# Altium project SVPXFMC_Carrier_3U.PrjPcb (part 6 of 7)

## Sheet SLT3-PAY-1Q2T_P1.SchDoc: SVPXFMC Carrier 3U
size A4; CheckedBy: \; Author: G.Kasprowicz; CompanyName: ISE; DrawnBy: T.Przywozki; Organization: WUT ISE; Address1: Warsaw University of Technology; Address2: Nowowiejska 15/19 00-665 Warsaw; Revision: 1.0.; SheetNumber: 13; SheetTotal: 20; Project: SVPXFMC Carrier 3U; ModifiedBy: -; CheckedDate: -; Title2: SpaceVPX P1, SLT3-PAY-1Q2T; DivGrp: ISE; Designer: G. Kasprowicz
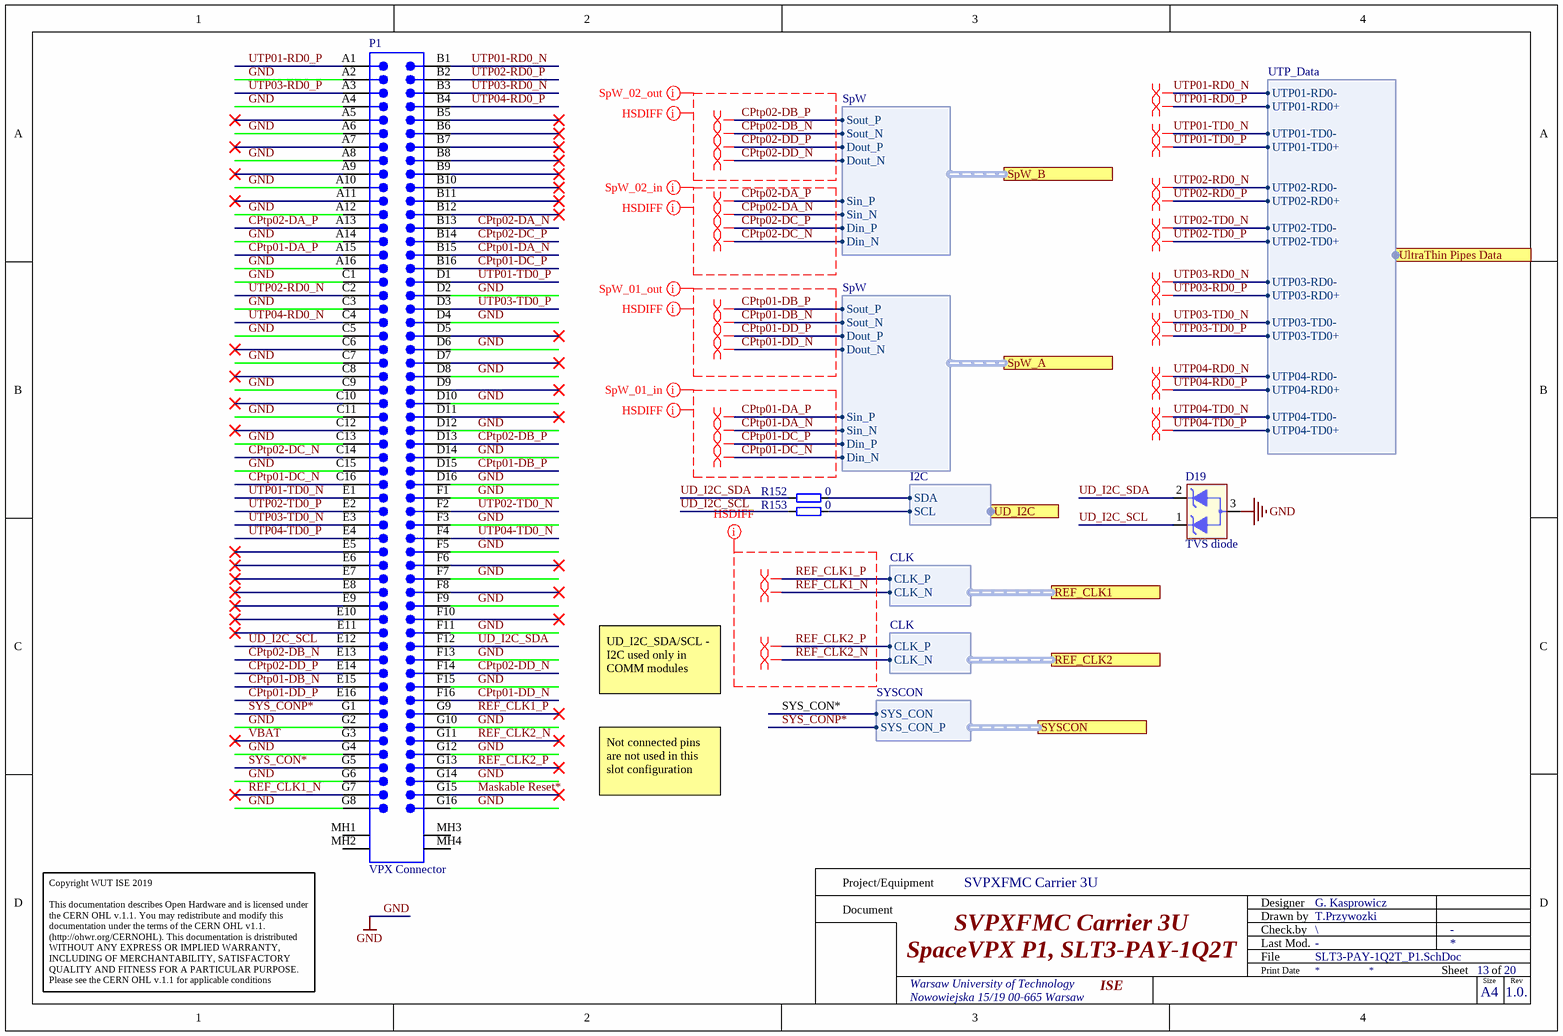
[diagram p14: SLT3-PAY-1Q2T_P1.SchDoc]

### Parts
D19  TVS diode  [SOT-723_(ESD7C3.3DT5G)]
P1  VPX Connector  [BTB1-8-4H112M]
R152  0  [RESC0603X28N]
R153  0  [RESC0603X28N]

### Ports
REF_CLK1 (harness CLK), REF_CLK2 (harness CLK), SpW_A (harness SpW), SpW_B (harness SpW), SYSCON (harness SYSCON), UD_I2C (harness I2C), UltraThin Pipes Data (harness UTP_Data)

### Harnesses
SpW: Sout_P, Sout_N, Dout_P, Dout_N, Sin_P, Sin_N, Din_P, Din_N
CLK: CLK_P, CLK_N
SYSCON: SYS_CON, SYS_CON_P
I2C: SDA, SCL
UTP_Data: UTP01-RD0-, UTP01-RD0+, UTP01-TD0-, UTP01-TD0+, UTP02-RD0-, UTP02-RD0+, UTP02-TD0-, UTP02-TD0+, UTP03-RD0-, UTP03-RD0+, UTP03-TD0-, UTP03-TD0+, UTP04-RD0-, UTP04-RD0+, UTP04-TD0-, UTP04-TD0+

### Nets
GND: D19.3 P1.A2 P1.A4 P1.A6 P1.A8 P1.A10 P1.A12 P1.A14 P1.A16 P1.C1 P1.C3 P1.C5 P1.C7 P1.C9 P1.C11 P1.C13 P1.C15 P1.D2 P1.D4 P1.D6 P1.D8 P1.D10 P1.D12 P1.D14 P1.D16 P1.F1 P1.F3 P1.F5 P1.F7 P1.F9 P1.F11 P1.F13 P1.F15 P1.G2 P1.G4 P1.G6 P1.G8 P1.G10 P1.G12 P1.G14 P1.G16
CPtp01-DA_N: P1.B15 ; port SpW_A.Sin_N
CPtp01-DA_P: P1.A15 ; port SpW_A.Sin_P
CPtp01-DB_N: P1.E15 ; port SpW_A.Sout_N
CPtp01-DB_P: P1.D15 ; port SpW_A.Sout_P
CPtp01-DC_N: P1.C16 ; port SpW_A.Din_N
CPtp01-DC_P: P1.B16 ; port SpW_A.Din_P
CPtp01-DD_N: P1.F16 ; port SpW_A.Dout_N
CPtp01-DD_P: P1.E16 ; port SpW_A.Dout_P
CPtp02-DA_N: P1.B13 ; port SpW_B.Sin_N
CPtp02-DA_P: P1.A13 ; port SpW_B.Sin_P
CPtp02-DB_N: P1.E13 ; port SpW_B.Sout_N
CPtp02-DB_P: P1.D13 ; port SpW_B.Sout_P
CPtp02-DC_N: P1.C14 ; port SpW_B.Din_N
CPtp02-DC_P: P1.B14 ; port SpW_B.Din_P
CPtp02-DD_N: P1.F14 ; port SpW_B.Dout_N
CPtp02-DD_P: P1.E14 ; port SpW_B.Dout_P
Maskable Reset*: P1.G15  [project net Maskable Reset*_13]
REF_CLK1_N: P1.G7 ; port REF_CLK1.CLK_N  [project net AUX_CLK_B_N]
REF_CLK1_P: P1.G9 ; port REF_CLK1.CLK_P  [project net AUX_CLK_B_P]
REF_CLK2_N: P1.G11 ; port REF_CLK2.CLK_N
REF_CLK2_P: P1.G13 ; port REF_CLK2.CLK_P
SYS_CON*: P1.G5 ; port SYSCON.SYS_CON  [project net SYS_CON]
SYS_CONP*: P1.G1 ; port SYSCON.SYS_CON_P  [project net SYS_CON_P]
UD_I2C_SCL: D19.1 P1.E12 R153.1  [project net UD_I2C_SCL_13]
UD_I2C_SDA: D19.2 P1.F12 R152.1  [project net UD_I2C_SDA_13]
UTP01-RD0_N: P1.B1 ; port UltraThin Pipes Data.UTP01-RD0-
UTP01-RD0_P: P1.A1 ; port UltraThin Pipes Data.UTP01-RD0+
UTP01-TD0_N: P1.E1 ; port UltraThin Pipes Data.UTP01-TD0-
UTP01-TD0_P: P1.D1 ; port UltraThin Pipes Data.UTP01-TD0+
UTP02-RD0_N: P1.C2 ; port UltraThin Pipes Data.UTP02-RD0-
UTP02-RD0_P: P1.B2 ; port UltraThin Pipes Data.UTP02-RD0+
UTP02-TD0_N: P1.F2 ; port UltraThin Pipes Data.UTP02-TD0-
UTP02-TD0_P: P1.E2 ; port UltraThin Pipes Data.UTP02-TD0+
UTP03-RD0_N: P1.B3 ; port UltraThin Pipes Data.UTP03-RD0-
UTP03-RD0_P: P1.A3 ; port UltraThin Pipes Data.UTP03-RD0+
UTP03-TD0_N: P1.E3 ; port UltraThin Pipes Data.UTP03-TD0-
UTP03-TD0_P: P1.D3 ; port UltraThin Pipes Data.UTP03-TD0+
UTP04-RD0_N: P1.C4 ; port UltraThin Pipes Data.UTP04-RD0-
UTP04-RD0_P: P1.B4 ; port UltraThin Pipes Data.UTP04-RD0+
UTP04-TD0_N: P1.F4 ; port UltraThin Pipes Data.UTP04-TD0-
UTP04-TD0_P: P1.E4 ; port UltraThin Pipes Data.UTP04-TD0+
VBAT: P1.G3  [project net VBAT_13]
NetR152_2: R152.2 ; port UD_I2C.SDA
NetR153_2: R153.2 ; port UD_I2C.SCL

Not connected (* = marked no-connect by the designer): P1 A5* A7* A9* A11* B5* B6* B7* B8* B9* B10* B11* B12* C6* C8* C10* C12* D5* D7* D9* D11* E5* E6* E7* E8* E9* E10* E11* F6* F8* F10* MH1 MH2 MH3 MH4

### Layout directives
differential pair: AUX_CLK_B_N, AUX_CLK_B_P, CPtp01-DA_N, CPtp01-DA_P, CPtp01-DB_N, CPtp01-DB_P, CPtp01-DC_N, CPtp01-DC_P, CPtp01-DD_N, CPtp01-DD_P, CPtp02-DA_N, CPtp02-DA_P, CPtp02-DB_N, CPtp02-DB_P, CPtp02-DC_N, CPtp02-DC_P, CPtp02-DD_N, CPtp02-DD_P, REF_CLK2_N, REF_CLK2_P, UTP01-RD0_N, UTP01-RD0_P, UTP01-TD0_N, UTP01-TD0_P, UTP02-RD0_N, UTP02-RD0_P, UTP02-TD0_N, UTP02-TD0_P, UTP03-RD0_N, UTP03-RD0_P, UTP03-TD0_N, UTP03-TD0_P, UTP04-RD0_N, UTP04-RD0_P, UTP04-TD0_N, UTP04-TD0_P
net class SpW_02_out: CPtp02-DB_N, CPtp02-DB_P, CPtp02-DD_N, CPtp02-DD_P
net class SpW_02_in: CPtp02-DA_N, CPtp02-DA_P, CPtp02-DC_N, CPtp02-DC_P
net class SpW_01_out: CPtp01-DB_N, CPtp01-DB_P, CPtp01-DD_N, CPtp01-DD_P
net class SpW_01_in: CPtp01-DA_N, CPtp01-DA_P, CPtp01-DC_N, CPtp01-DC_P
net class HSDIFF: CPtp01-DA_N, CPtp01-DA_P, CPtp01-DB_N, CPtp01-DB_P, CPtp01-DC_N, CPtp01-DC_P, CPtp01-DD_N, CPtp01-DD_P, CPtp02-DA_N, CPtp02-DA_P, CPtp02-DB_N, CPtp02-DB_P, CPtp02-DC_N, CPtp02-DC_P, CPtp02-DD_N, CPtp02-DD_P, REF_CLK1_N, REF_CLK1_P, REF_CLK2_N, REF_CLK2_P

### Notes on the sheet
- UD_I2C_SDA/SCL - I2C used only in COMM modules
- Not connected pins are not used in this slot configuration
- Project/Equipment
- Document
- Designer
- Drawn by
- Check.by
- Copyright WUT ISE 2019
  This documentation describes Open Hardware and is licensed under the CERN OHL v.1.1. You may redistribute and modify this documentation under the terms of the CERN OHL v1.1.
  (http://ohwr.org/CERNOHL). This documentation is dristributed WITHOUT ANY EXPRESS OR IMPLIED WARRANTY, INCLUDING OF MERCHANTABILITY, SATISFACTORY QUALITY AND FITNESS FOR A PARTICULAR PURPOSE. Please see the CERN OHL v.1.1 for applicable conditions
- File
- Last Mod.
- Print Date
- Sheet
- Size
- A4
- of
- Rev

### Library data of the parts
D19 = ESD7C3.3DT5G: Dual TVS diode, Vrwm=3.3V; Manufacturer: ON Semiconductor; Bonding: No; ComponentHeigth: 0.5mm; PressFit: No; Value: 3.3V; Case: SOT-723; Component Kind: Standard; Component Type: Standard; CreateDate: 2018-06-18; Device: TVS diode; HelpURL: https://www.onsemi.com/pub/Collateral/ESD7C3.3D-D.PDF; LatestRevisionDate: 2018-06-18; Manufacturer Part Number: ESD7C3.3DT5G; Mounted: Yes; PackageDescription: SOT-723; Part Description: TVS diode; Part Number: ESD7C3.3DT5G; Pin Count: 3; Sense: No; SMD: Yes; Socket: No
P1 = 2102771-1: Ruggedized Board-to-Board Connector, Right Angle, 7-Row, Pitch 1.8mm, 112-Position; Manufacturer: TE; Bonding: No; ComponentHeigth: 14.7mm; PressFit: No; Case: *; Component Kind: Standard; Component Type: Standard; CreateDate: 2018-01-01; Device: *; Footprint: *; HelpURL: *; LatestRevisionDate: 2018-01-01; Manufacturer Part Number: 2102771-1; Mounted: Yes; PackageDescription: 2102771-1; Part Description: Ruggedized Board-to-Board Connector, Right Angle, 7-Row, Pitch 1.8mm, 112-Position; Part Number: 2102771-1; Pin Count: *; Sense: No; SMD: Yes; Socket: No; Family: VPX Connector
R152 R153 = R0201_0R_JUMPER: Resistor; Part Description: 1A (0.05R Max DC Resistance) Zero Ohm Jumper; Manufacturer: GENERIC; Manufacturer1 Part Number: CRCW02010000Z0ED; PressFit: No; Part Number: R0201_0R_JUMPER; Component Kind: Standard; Component Type: Standard; Pin Count: 2; Value: 0; Status: Not Recommended; Manufacturer Part Number: R0201_0R_JUMPER; Case: 0201; Mounted: Yes; Sense: No; Socket: No; SMD: Yes; Manufacturer1 Example: VISHAY; Manufacturer1 ComponentHeight: 0.27mm; HelpURL: \\cern.ch\dfs\Applications\Altium\Datasheets\R0201_VISHAY_CRCW e3.pdf; Author: CERN DEM JLC; CreateDate: 19.11.2014; LatestRevisionDate: 08.01.2015

## Sheet SLT3-PAY-1Q2T_P2.SchDoc: SVPXFMC Carrier 3U
size A4; CheckedBy: \; Author: G.Kasprowicz; CompanyName: ISE; DrawnBy: T.Przywozki; Organization: WUT ISE; Address1: Warsaw University of Technology; Address2: Nowowiejska 15/19 00-665 Warsaw; Revision: 1.0.; SheetNumber: 12; SheetTotal: 20; Project: SVPXFMC Carrier 3U; ModifiedBy: -; CheckedDate: -; Title2: SpaceVPX P2, SLT3-PAY-1Q2T; DivGrp: ISE; Designer: G. Kasprowicz
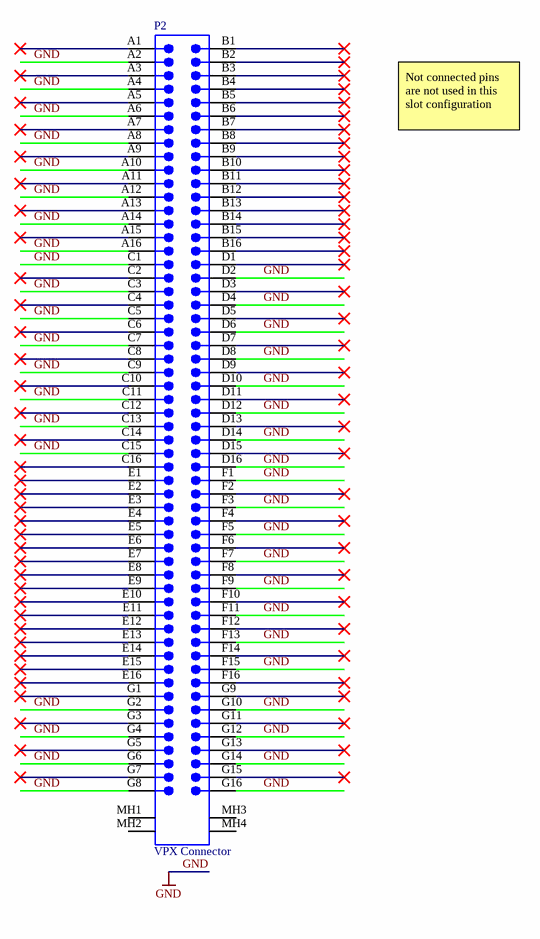
[diagram p15: SLT3-PAY-1Q2T_P2.SchDoc]

### Parts
P2  VPX Connector  [BTB1-8-4H112M]

### Nets
GND: P2.A2 P2.A4 P2.A6 P2.A8 P2.A10 P2.A12 P2.A14 P2.A16 P2.C1 P2.C3 P2.C5 P2.C7 P2.C9 P2.C11 P2.C13 P2.C15 P2.D2 P2.D4 P2.D6 P2.D8 P2.D10 P2.D12 P2.D14 P2.D16 P2.F1 P2.F3 P2.F5 P2.F7 P2.F9 P2.F11 P2.F13 P2.F15 P2.G2 P2.G4 P2.G6 P2.G8 P2.G10 P2.G12 P2.G14 P2.G16

Not connected (* = marked no-connect by the designer): P2 A1* A3* A5* A7* A9* A11* A13* A15* B1* B2* B3* B4* B5* B6* B7* B8* B9* B10* B11* B12* B13* B14* B15* B16* C2* C4* C6* C8* C10* C12* C14* C16* D1* D3* D5* D7* D9* D11* D13* D15* E1* E2* E3* E4* E5* E6* E7* E8* E9* E10* E11* E12* E13* E14* E15* E16* F2* F4* F6* F8* F10* F12* F14* F16* G1* G3* G5* G7* G9* G11* G13* G15* MH1 MH2 MH3 MH4

### Notes on the sheet
- Not connected pins are not used in this slot configuration
- Project/Equipment
- Document
- Designer
- Drawn by
- Check.by
- Copyright WUT ISE 2019
  This documentation describes Open Hardware and is licensed under the CERN OHL v.1.1. You may redistribute and modify this documentation under the terms of the CERN OHL v1.1.
  (http://ohwr.org/CERNOHL). This documentation is dristributed WITHOUT ANY EXPRESS OR IMPLIED WARRANTY, INCLUDING OF MERCHANTABILITY, SATISFACTORY QUALITY AND FITNESS FOR A PARTICULAR PURPOSE. Please see the CERN OHL v.1.1 for applicable conditions
- File
- Last Mod.
- Print Date
- Sheet
- Size
- A4
- of
- Rev

### Library data of the parts
P2 = 2102771-1: as P1 on sheet SLT3-PAY-1Q2T_P1; Case: *; Component Kind: Standard; Component Type: Standard; CreateDate: 2018-01-01; Device: *; Footprint: *; HelpURL: *; LatestRevisionDate: 2018-01-01; Manufacturer Part Number: 2102771-1; Mounted: Yes; PackageDescription: 2102771-1; Part Description: Ruggedized Board-to-Board Connector, Right Angle, 7-Row, Pitch 1.8mm, 112-Position; Part Number: 2102771-1; Pin Count: *; Sense: No; SMD: Yes; Socket: No; Family: VPX Connector

## Sheet Management.SchDoc: SVPXFMC Carrier 3U
size A4; CheckedBy: \; Author: G.Kasprowicz; CompanyName: ISE; DrawnBy: T.Przywozki; Organization: WUT ISE; Address1: Warsaw University of Technology; Address2: Nowowiejska 15/19 00-665 Warsaw; Revision: 1.0.; SheetNumber: 16; SheetTotal: 20; Project: SVPXFMC Carrier 3U; ModifiedBy: -; CheckedDate: -; Title2: MSP430 management MCU; DivGrp: ISE; Designer: G. Kasprowicz
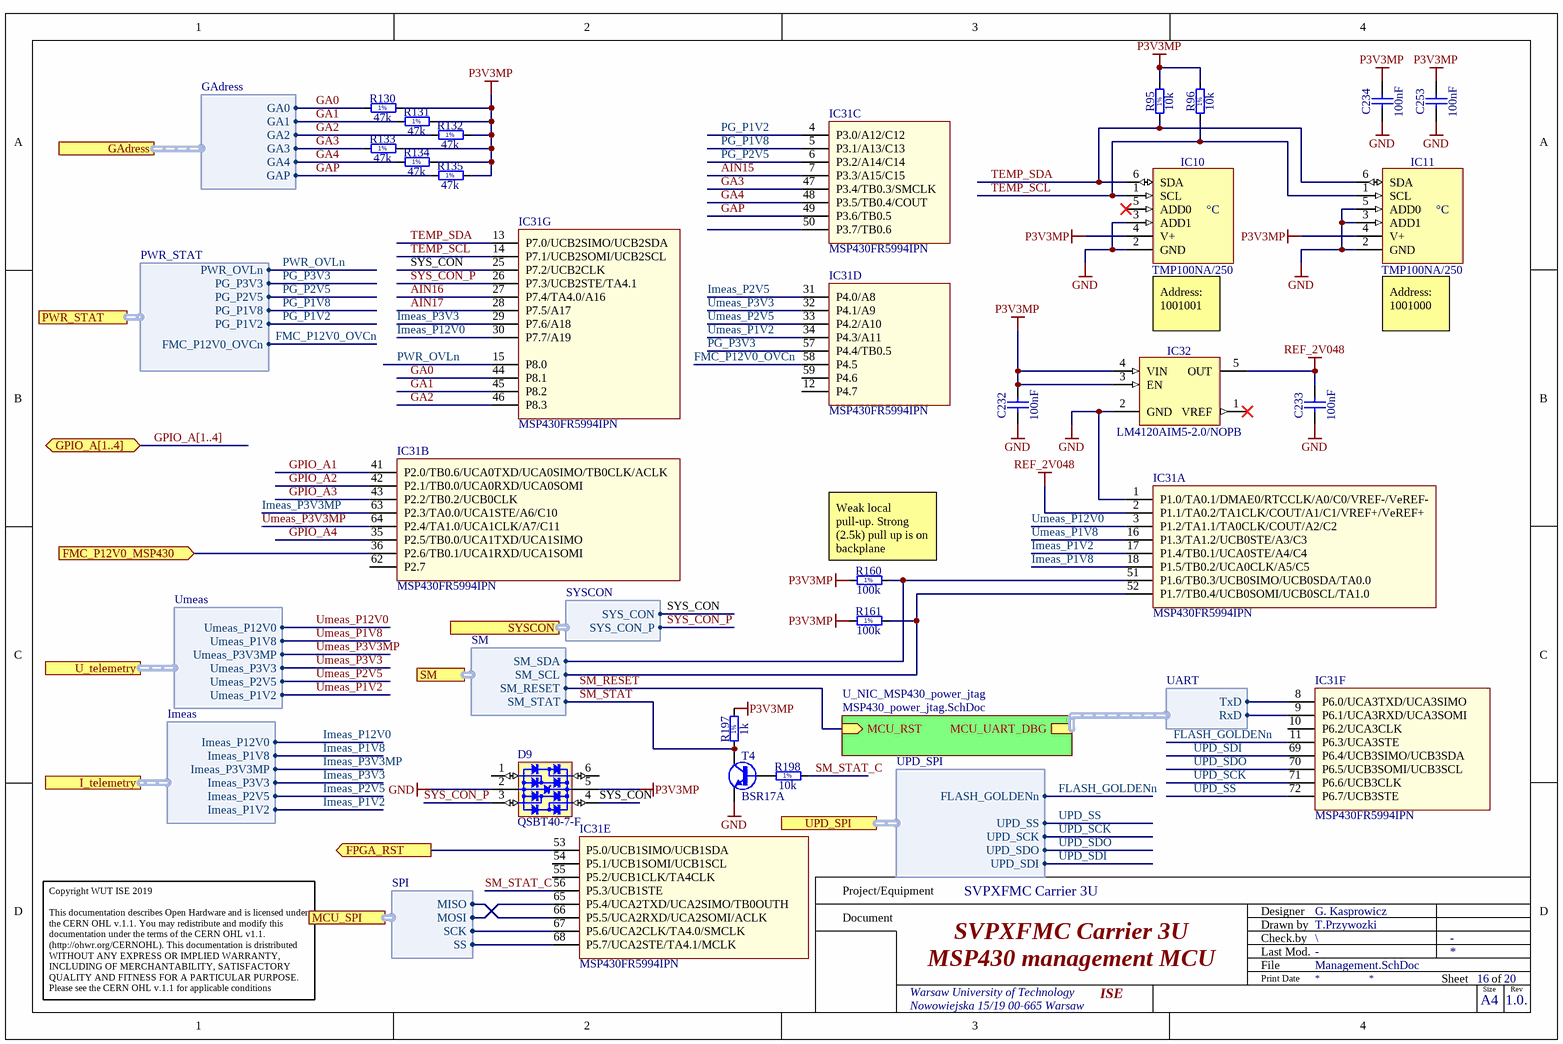
[diagram p16: Management.SchDoc]

### Parts
C232  100nF  [CAPC1005X55N]
C233  100nF  [CAPC1005X55N]
C234  100nF  [CAPC1005X55N]
C253  100nF  [CAPC1005X55N]
D9  QSBT40-7-F  [SOT65P210X110-6N]
IC10  TMP100NA/250  [SOT95P280X145-6N]
IC11  TMP100NA/250  [SOT95P280X145-6N]
IC31  MSP430FR5994IPN  [PQFP50P1400X1400-80N]  (parts A,B,C,D,E,F,G of 9)
IC32  LM4120AIM5-2.0/NOPB  [SOT95P280X145-5N]
R95  10k  [RESC1005X40N]
R96  10k  [RESC1005X40N]
R130  47k  [RESC1005X40N]
R131  47k  [RESC1005X40N]
R132  47k  [RESC1005X40N]
R133  47k  [RESC1005X40N]
R134  47k  [RESC1005X40N]
R135  47k  [RESC1005X40N]
R160  100k  [RESC1005X40N]
R161  100k  [RESC1005X40N]
R197  1k  [RESC1005X40N]
R198  10k  [RESC1005X40N]
T4  BSR17A  [SOT95P240X110-3N]

### Sub-sheets
U_NIC_MSP430_power_jtag = MSP430_power_jtag.SchDoc: MCU_UART_DBG (harness UART), MCU_RST (in)

### Ports
FMC_P12V0_MSP430 (in), FPGA_RST (out), GAdress (harness GAdress), GPIO_A[1..4] (bidir), I_telemetry (harness Imeas), MCU_SPI (harness SPI), PWR_STAT (harness PWR_STAT), SM (harness SM), SYSCON (harness SYSCON), U_telemetry (harness Umeas), UPD_SPI (harness UPD_SPI)

### Harnesses
SPI: MISO, MOSI, SCK, SS
UART: TxD, RxD
SM: SM_SCL, SM_SDA, SM_RESET, SM_STAT
GAdress: GA0, GA1, GA2, GA3, GA4, GAP
PWR_STAT: FMC_P12V0_OVCn, PG_P1V2, PG_P1V8, PG_P2V5, PG_P3V3, PWR_OVLn
SYSCON: SYS_CON, SYS_CON_P
UPD_SPI: UPD_SS, UPD_SCK, UPD_SDO, UPD_SDI, FLASH_GOLDENn
Imeas: Imeas_P12V0, Imeas_P1V8, Imeas_P3V3, Imeas_P2V5, Imeas_P1V2, Imeas_P3V3MP
Umeas: Umeas_P12V0, Umeas_P1V8, Umeas_P3V3, Umeas_P2V5, Umeas_P1V2, Umeas_P3V3MP

### Nets
GND: C232.1 C233.1 C234.1 C253.1 D9.2(GND) IC10.2(GND) IC10.3(ADD1) IC11.2(GND) IC11.3(ADD1) IC11.5(ADD0) IC31.1(P1.0/TA0.1/DMAE0/RTCCLK/A0/C0/VREF-/VeREF-) IC32.2(GND) T4.2(E)
P3V3MP: C232.2 C234.2 C253.2 D9.5(VBUS) IC10.4(V+) IC11.4(V+) IC32.3(EN) IC32.4(VIN) R95.2 R96.2 R130.2 R131.2 R132.2 R133.2 R134.2 R135.2 R160.1 R161.1 R197.2
REF_2V048: C233.2 IC31.2(P1.1/TA0.2/TA1CLK/COUT/A1/C1/VREF+/VeREF+) IC32.5(OUT)
AIN15: IC31.7(P3.3/A15/C15)  [project net AIN15_16]
AIN16: IC31.27(P7.4/TA4.0/A16)  [project net AIN16_16]
AIN17: IC31.28(P7.5/A17)  [project net AIN17_16]
EXT_RST_2: IC31.53(P5.0/UCB1SIMO/UCB1SDA) ; port FPGA_RST
FLASH_GOLDENn: IC31.11(P6.3/UCA3STE) ; port UPD_SPI.FLASH_GOLDENn
FMC_P12V0_MSP430: IC31.36(P2.6/TB0.1/UCA1RXD/UCA1SOMI) ; port FMC_P12V0_MSP430
FMC_P12V0_OVCn: IC31.58(P4.5) ; port PWR_STAT.FMC_P12V0_OVCn
GA0: IC31.44(P8.1) R130.1 ; port GAdress.GA0
GA1: IC31.45(P8.2) R131.1 ; port GAdress.GA1
GA2: IC31.46(P8.3) R132.1 ; port GAdress.GA2
GA3: IC31.47(P3.4/TB0.3/SMCLK) R133.1 ; port GAdress.GA3
GA4: IC31.48(P3.5/TB0.4/COUT) R134.1 ; port GAdress.GA4
GAP: IC31.49(P3.6/TB0.5) R135.1 ; port GAdress.GAP
GPIO_A1: IC31.41(P2.0/TB0.6/UCA0TXD/UCA0SIMO/TB0CLK/ACLK)
GPIO_A2: IC31.42(P2.1/TB0.0/UCA0RXD/UCA0SOMI)
GPIO_A3: IC31.43(P2.2/TB0.2/UCB0CLK)
GPIO_A4: IC31.35(P2.5/TB0.0/UCA1TXD/UCA1SIMO)
Imeas_P1V2: IC31.17(P1.4/TB0.1/UCA0STE/A4/C4) ; port I_telemetry.Imeas_P1V2
Imeas_P1V8: IC31.18(P1.5/TB0.2/UCA0CLK/A5/C5) ; port I_telemetry.Imeas_P1V8
Imeas_P2V5: IC31.31(P4.0/A8) ; port I_telemetry.Imeas_P2V5
Imeas_P3V3: IC31.29(P7.6/A18) ; port I_telemetry.Imeas_P3V3
Imeas_P3V3MP: IC31.63(P2.3/TA0.0/UCA1STE/A6/C10) ; port I_telemetry.Imeas_P3V3MP
Imeas_P12V0: IC31.30(P7.7/A19) ; port I_telemetry.Imeas_P12V0
PG_P1V2: IC31.4(P3.0/A12/C12) ; port PWR_STAT.PG_P1V2
PG_P1V8: IC31.5(P3.1/A13/C13) ; port PWR_STAT.PG_P1V8
PG_P2V5: IC31.6(P3.2/A14/C14) ; port PWR_STAT.PG_P2V5
PG_P3V3: IC31.57(P4.4/TB0.5) ; port PWR_STAT.PG_P3V3
PWR_OVLn: IC31.15(P8.0) ; port PWR_STAT.PWR_OVLn
RxD: IC31.9(P6.1/UCA3RXD/UCA3SOMI) ; sheet U_NIC_MSP430_power_jtag/MCU_UART_DBG.RxD
SM0: IC31.52(P1.7/TB0.4/UCB0SOMI/UCB0SCL/TA1.0) R161.2 ; port SM.SM_SCL
SM1: IC31.51(P1.6/TB0.3/UCB0SIMO/UCB0SDA/TA0.0) R160.2 ; port SM.SM_SDA
SM_RESET: sheet U_NIC_MSP430_power_jtag/MCU_RST, port SM.SM_RESET  [project net SM2]
SM_STAT: R197.1 T4.3(C) ; port SM.SM_STAT  [project net SM3]
SM_STAT_C: IC31.56(P5.3/UCB1STE) R198.2  [project net SM_STAT_C_16]
SYS_CON: D9.4(I/O3) IC31.25(P7.2/UCB2CLK) ; port SYSCON.SYS_CON
SYS_CON_P: D9.3(I/O2) IC31.26(P7.3/UCB2STE/TA4.1) ; port SYSCON.SYS_CON_P
TEMP_SCL: IC10.1(SCL) IC11.1(SCL) IC31.14(P7.1/UCB2SOMI/UCB2SCL) R96.1  [project net TEMP_SCL_16]
TEMP_SDA: IC10.6(SDA) IC11.6(SDA) IC31.13(P7.0/UCB2SIMO/UCB2SDA) R95.1  [project net TEMP_SDA_16]
TxD: IC31.8(P6.0/UCA3TXD/UCA3SIMO) ; sheet U_NIC_MSP430_power_jtag/MCU_UART_DBG.TxD
Umeas_P1V2: IC31.34(P4.3/A11) ; port U_telemetry.Umeas_P1V2
Umeas_P1V8: IC31.16(P1.3/TA1.2/UCB0STE/A3/C3) ; port U_telemetry.Umeas_P1V8
Umeas_P2V5: IC31.33(P4.2/A10) ; port U_telemetry.Umeas_P2V5
Umeas_P3V3: IC31.32(P4.1/A9) ; port U_telemetry.Umeas_P3V3
Umeas_P3V3MP: IC31.64(P2.4/TA1.0/UCA1CLK/A7/C11) ; port U_telemetry.Umeas_P3V3MP
Umeas_P12V0: IC31.3(P1.2/TA1.1/TA0CLK/COUT/A2/C2) ; port U_telemetry.Umeas_P12V0
UPD_SCK: IC31.71(P6.6/UCB3CLK) ; port UPD_SPI.UPD_SCK
UPD_SDI: IC31.69(P6.4/UCB3SIMO/UCB3SDA) ; port UPD_SPI.UPD_SDI
UPD_SDO: IC31.70(P6.5/UCB3SOMI/UCB3SCL) ; port UPD_SPI.UPD_SDO
UPD_SS: IC31.72(P6.7/UCB3STE) ; port UPD_SPI.UPD_SS
NetIC13_1: IC31.66(P5.5/UCA2RXD/UCA2SOMI/ACLK) ; port MCU_SPI.MISO
NetIC13_4: IC31.65(P5.4/UCA2TXD/UCA2SIMO/TB0OUTH) ; port MCU_SPI.MOSI
NetIC13_8: IC31.67(P5.6/UCA2CLK/TA4.0/SMCLK) ; port MCU_SPI.SCK
NetIC13_11: IC31.68(P5.7/UCA2STE/TA4.1/MCLK) ; port MCU_SPI.SS
NetR198_1: R198.1 T4.1(B)

Not connected (* = marked no-connect by the designer): D9 1(I/O1) 6(I/O4); IC10 5(ADD0)*; IC31 10(P6.2/UCA3CLK) 12(P4.7) 50(P3.7/TB0.6) 54(P5.1/UCB1SOMI/UCB1SCL) 55(P5.2/UCB1CLK/TA4CLK) 59(P4.6) 62(P2.7); IC32 1(VREF)*

### Buses and harness runs
bus GPIO_A[1..4] = port GPIO_A[1..4]

### Notes on the sheet
- Address: 1001001
- (near IC11) Address: 1001000
- (near R160) Weak local pull-up. Strong (2.5k) pull up is on backplane
- Project/Equipment
- Document
- Designer
- Drawn by
- Check.by
- Copyright WUT ISE 2019
  This documentation describes Open Hardware and is licensed under the CERN OHL v.1.1. You may redistribute and modify this documentation under the terms of the CERN OHL v1.1.
  (http://ohwr.org/CERNOHL). This documentation is dristributed WITHOUT ANY EXPRESS OR IMPLIED WARRANTY, INCLUDING OF MERCHANTABILITY, SATISFACTORY QUALITY AND FITNESS FOR A PARTICULAR PURPOSE. Please see the CERN OHL v.1.1 for applicable conditions
- File
- Last Mod.
- Print Date
- Sheet
- Size
- A4
- of
- Rev
- (in symbol R0402_1K_1%_0.0625W_100PPM) 1%
- (in symbol R0402_10K_1%_0.0625W_100PPM) 1%
- (in symbol R0402_47K_1%_0.0625W_100PPM) 1%
- (in symbol R0402_100K_1%_0.0625W_100PPM) 1%
- (in symbol TMP100NA/250) °C

### Library data of the parts
C232-C234 C253 = CC0402_100NF_25V_10%_X7R_YUDEN_TMK105B7104KVHF: as C161-C163 on sheet Decoupling_caps; Part Number: CC0402_100NF_25V_10%_X7R_YUDEN_TMK105B7104KVHF; Component Kind: Standard; Component Type: Standard; Pin Count: 2; Value: 100nF; Status: Not Recommended; Manufacturer Part Number: TMK105B7104KVHF; Case: 0402; Mounted: Yes; Socket: No; SMD: Yes; Sense: No; HelpURL: \\cern.ch\dfs\Applications\Altium\Datasheets\CC0402_TAIYO-YUDEN_TMK105B7104KVHF.pdf; Author: CERN DEM JLC; ComponentHeight: 0.55mm
  C232 C233: CreateDate: 10.05.2017; LatestRevisionDate: 10.05.2017
  C234 C253: CreateDate: 10/05/2017; LatestRevisionDate: 10/05/2017
D9 = D_TVS_QSBT40-7-F: Bonding: No; PressFit: No; Case: *; Component Kind: Standard; Component Type: Standard; ComponentHeigth: *; CreateDate: 2018-01-01; Device: QSBT40-7-F; Footprint: SOT363; HelpURL: *; LatestRevisionDate: 2018-01-01; Manufacturer: *; Manufacturer Part Number: QSBT40-7-F; Mounted: Yes; PackageDescription: *; Part Description: *; Part Number: *; Pin Count: 6; Sense: No; SMD: Yes; Socket: No; Value: *
IC10 IC11 = TMP100NA/250: Digital Temperature Sensor with I2C Interface; Part Description: -55°C to +125°C, ±3.0°C Accuracy, Digital Temperature Sensor with I2C Interface; Manufacturer: TEXAS INSTRUMENTS; PressFit: No; Bonding: No; Part Number: TMP100NA/250; Component Kind: Standard; Component Type: Standard; Device: TMP100NA/250; PackageDescription: SOT23, 6-Leads, Body 1.6x3.0mm, Pitch 0.95mm, IPC Medium Density; Manufacturer Part Number: TMP100NA/250; Pin Count: 6; Case: SOT23-6; Mounted: Yes; Socket: No; SMD: Yes; Sense: No; ComponentHeight: 1.45mm; HelpURL: \\cern.ch\dfs\Applications\Altium\Datasheets\TMP100NA-250.pdf; Author: CERN DEM JLC; CreateDate: 29.10.2012; LatestRevisionDate: 29.10.2012
IC31 = MSP430FR5994IPN: Manufacturer: TI; Part Description: FRAM microcontroller; Bonding: No; ComponentHeigth: 2mm; PressFit: No; Case: LQFP80; Component Kind: Standard; Component Type: Standard; CreateDate: 2018-01-01; Device: MSP430FR5994IPN; Footprint: LQFP80; HelpURL: *; LatestRevisionDate: 2018-01-01; Manufacturer Part Number: MSP430FR5994IPN; Mounted: Yes; PackageDescription: LQFP80; Part Number: MSP430FR5994IPN; Pin Count: 80; Sense: No; SMD: Yes; Socket: No; Value: *
IC32 = LM4120AIM5-2.0/NOPB: Precision Micropower Low Dropout Voltage Reference; Part Description: 2.048V Precision Micropower Low Dropout Voltage Reference; Manufacturer: TEXAS INSTRUMENTS; PressFit: No; Bonding: No; Part Number: LM4120AIM5-2.0/NOPB; Component Kind: Standard; Component Type: Standard; Device: LM4120AIM5-2.0/NOPB; PackageDescription: SOT, 0.95mm Pitch; 5 Pin, 1.60mm W X 2.90mm L X 1.45mm H Body, IPC Medium Density; Manufacturer Part Number: LM4120AIM5-2.0/NOPB; Pin Count: 5; Case: SOT23-5; Mounted: Yes; Socket: No; SMD: Yes; Sense: No; ComponentHeight: 1.45mm; HelpURL: \\cern.ch\dfs\Applications\Altium\Datasheets\LM4120AIM5-2.0-NOPB.pdf; Author: CERN DEM JMW; CreateDate: 2016-08-31; LatestRevisionDate: 2016-08-31
R95 R96 R198 = R0402_10K_1%_0.0625W_100PPM: Resistor - 1%; Part Description: General Purpose Thick Film Chip Resistor; Manufacturer: GENERIC; Manufacturer1 Part Number: 232270671003L; TC: ±100ppm/°C; PressFit: No; Part Number: R0402_10K_1%_0.0625W_100PPM; Component Kind: Standard; Component Type: Standard; Pin Count: 2; Value: 10k; Status: Not Recommended; Power: 0.0625W; Tolerance: ±1%; Manufacturer Part Number: R0402_10K_1%_0.0625W_100PPM; Case: 0402; Mounted: Yes; Sense: No; Socket: No; SMD: Yes; Manufacturer1 Example: YAGEO PHYCOMP; Manufacturer1 ComponentHeight: 0.4mm; HelpURL: \\cern.ch\dfs\Applications\Altium\Datasheets\R0402_Phycomp_RC0402.pdf; Author: CERN DEM JLC
  R95 R96: CreateDate: 03.12.2007; LatestRevisionDate: 17.10.2012
  R198: CreateDate: 03/12/2007; LatestRevisionDate: 17/10/2012
R130-R135 = R0402_47K_1%_0.0625W_100PPM: Resistor - 1%; Part Description: General Purpose Thick Film Chip Resistor; Manufacturer: GENERIC; Manufacturer1 Part Number: 232270675103L; TC: ±100ppm/°C; PressFit: No; Part Number: R0402_47K_1%_0.0625W_100PPM; Component Kind: Standard; Component Type: Standard; Pin Count: 2; Value: 47k; Status: Not Recommended; Power: 0.0625W; Tolerance: ±1%; Manufacturer Part Number: R0402_47K_1%_0.0625W_100PPM; Case: 0402; Mounted: Yes; Sense: No; Socket: No; SMD: Yes; Manufacturer1 Example: YAGEO PHYCOMP; Manufacturer1 ComponentHeight: 0.4mm; HelpURL: \\cern.ch\dfs\Applications\Altium\Datasheets\R0402_Phycomp_RC0402.pdf; Author: CERN DEM JLC; CreateDate: 03.12.2007; LatestRevisionDate: 17.10.2012
R160 R161 = R0402_100K_1%_0.0625W_100PPM: Resistor - 1%; Part Description: General Purpose Thick Film Chip Resistor; Manufacturer: GENERIC; Manufacturer1 Part Number: 232270671004L; TC: ±100ppm/°C; PressFit: No; Part Number: R0402_100K_1%_0.0625W_100PPM; Component Kind: Standard; Component Type: Standard; Pin Count: 2; Value: 100k; Status: Not Recommended; Power: 0.0625W; Tolerance: ±1%; Manufacturer Part Number: R0402_100K_1%_0.0625W_100PPM; Case: 0402; Mounted: Yes; Sense: No; Socket: No; SMD: Yes; Manufacturer1 Example: YAGEO PHYCOMP; Manufacturer1 ComponentHeight: 0.4mm; HelpURL: \\cern.ch\dfs\Applications\Altium\Datasheets\R0402_Phycomp_RC0402.pdf; Author: CERN DEM JLC; CreateDate: 03.12.2007; LatestRevisionDate: 17.10.2012
R197 = R0402_1K_1%_0.0625W_100PPM: Resistor - 1%; Part Description: General Purpose Thick Film Chip Resistor; Manufacturer: GENERIC; Manufacturer1 Part Number: 232270671002L; TC: ±100ppm/°C; PressFit: No; Part Number: R0402_1K_1%_0.0625W_100PPM; Component Kind: Standard; Component Type: Standard; Pin Count: 2; Value: 1k; Status: Not Recommended; Power: 0.0625W; Tolerance: ±1%; Manufacturer Part Number: R0402_1K_1%_0.0625W_100PPM; Case: 0402; Mounted: Yes; Sense: No; Socket: No; SMD: Yes; Manufacturer1 Example: YAGEO PHYCOMP; Manufacturer1 ComponentHeight: 0.4mm; HelpURL: \\cern.ch\dfs\Applications\Altium\Datasheets\R0402_Phycomp_RC0402.pdf; Author: CERN DEM JLC; CreateDate: 03.12.2007; LatestRevisionDate: 17.10.2012
T4 = BSR17A: NPN Transistor; Part Description: 40V 200mA NPN General-Purpose Amplifier; Manufacturer: FAIRCHILD SEMICONDUCTOR; PressFit: No; Bonding: No; Part Number: BSR17A; Component Kind: Standard; Component Type: Standard; Device: BSR17A; PackageDescription: SOT23 3-Leads, Pitch 0.95mm - Body 1.4x3mm, IPC Medium Density; Manufacturer Part Number: BSR17A; Pin Count: 3; Case: SOT23-3; Mounted: Yes; Socket: No; SMD: Yes; Sense: No; ComponentHeight: 1.3mm; HelpURL: \\cern.ch\dfs\Applications\Altium\Datasheets\BSR17A.pdf; Author: CERN DEM JLC; CreateDate: 14.05.2008; LatestRevisionDate: 14.05.2008

## Sheet MSP430_power_jtag.SchDoc: SVPXFMC Carrier 3U
size A4; CheckedBy: \; Author: G.Kasprowicz; CompanyName: ISE; DrawnBy: T.Przywozki; Organization: WUT ISE; Address1: Warsaw University of Technology; Address2: Nowowiejska 15/19 00-665 Warsaw; Revision: 1.0.; SheetNumber: 17; SheetTotal: 20; Project: SVPXFMC Carrier 3U; ModifiedBy: -; CheckedDate: -; Title2: MSP430 power and JTAG; DivGrp: ISE; Designer: G. Kasprowicz
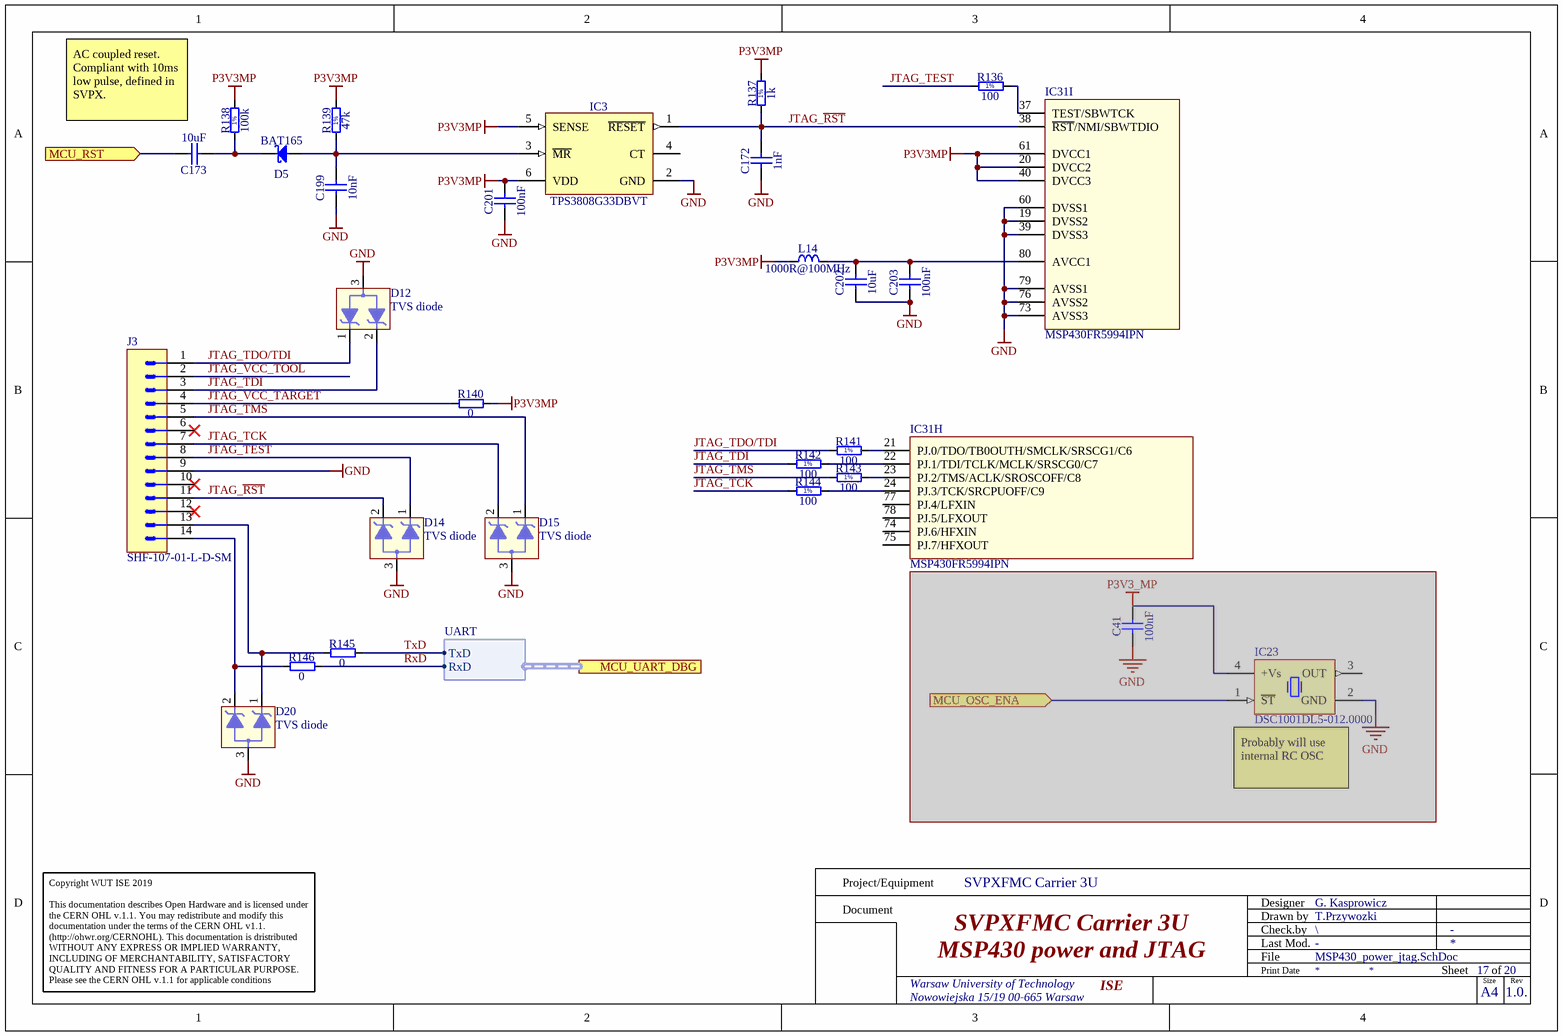
[diagram p17: MSP430_power_jtag.SchDoc]

### Parts
(Parts that share a designator on the sheet are numbered #1, #2 ... from top to bottom, then left to right.)
C41#2  100nF  [CAPC1005X55N]  (masked out: inside a compile mask, not in the netlist)
C172  1nF  [CAPC1005X55N]
C173  10uF  [CAPC1608X80N]
C199  10nF  [CAPC1005X55N]
C201  100nF  [CAPC1005X55N]
C202  10uF  [CAPC1608X80N]
C203  100nF  [CAPC1005X55N]
D5  BAT165  [SOD2512X110N]
D12  TVS diode  [SOT-723_(ESD7C3.3DT5G)]
D14  TVS diode  [SOT-723_(ESD7C3.3DT5G)]
D15  TVS diode  [SOT-723_(ESD7C3.3DT5G)]
D20  TVS diode  [SOT-723_(ESD7C3.3DT5G)]
IC3  TPS3808G33DBVT  [SOT95P280X145-6N]
IC23  DSC1001DL5-012.0000  [OSC_MICREL_2520]  (masked out: inside a compile mask, not in the netlist)
IC31  MSP430FR5994IPN  [PQFP50P1400X1400-80N]  (parts H,I of 9)
J3  SHF-107-01-L-D-SM  [SHF-107-01-L-D-SM-LC]
L14  1000R@100MHz  [INDC1608X95N]
R136  100  [RESC1005X40N]
R137  1k  [RESC1005X40N]
R138  100k  [RESC1005X40N]
R139  47k  [RESC1005X40N]
R140  0  [RESC1608X55N]
R141  100  [RESC1005X40N]
R142  100  [RESC1005X40N]
R143  100  [RESC1005X40N]
R144  100  [RESC1005X40N]
R145  0  [RESC1608X55N]
R146  0  [RESC1608X55N]

### Ports
MCU_OSC_ENA (in), MCU_RST (in), MCU_UART_DBG (harness UART)

### Harnesses
UART: TxD, RxD

### Nets
GND: C172.1 C199.1 C201.1 C202.1 C203.1 D12.3 D14.3 D15.3 D20.3 IC3.2(GND) IC31.19(DVSS2) IC31.39(DVSS3) IC31.60(DVSS1) IC31.73(AVSS3) IC31.76(AVSS2) IC31.79(AVSS1) J3.9
P3V3MP: C201.2 IC3.5(SENSE) IC3.6(VDD) IC31.20(DVCC2) IC31.40(DVCC3) IC31.61(DVCC1) L14.1 R137.2 R138.2 R139.2 R140.2
JTAG_~{RST}: C172.2 D14.2 IC3.1(~{RESET}) IC31.38(~{RST}/NMI/SBWTDIO) J3.11 R137.1  [project net JTAG_~{RST}_17]
JTAG_TCK: D15.2 J3.7 R144.1  [project net JTAG_TCK_17]
JTAG_TDI: D12.2 J3.3 R142.1  [project net JTAG_TDI_17]
JTAG_TDO/TDI: D12.1 J3.1 R141.1  [project net JTAG_TDO/TDI_17]
JTAG_TEST: D14.1 J3.8 R136.1  [project net JTAG_TEST_17]
JTAG_TMS: D15.1 J3.5 R143.1  [project net JTAG_TMS_17]
JTAG_VCC_TARGET: J3.4 R140.1  [project net JTAG_VCC_TARGET_17]
JTAG_VCC_TOOL: J3.2  [project net JTAG_VCC_TOOL_17]
RxD: R146.2 ; port MCU_UART_DBG.RxD
SM2: C173.2 ; port MCU_RST
TxD: R145.2 ; port MCU_UART_DBG.TxD
NetC173_1: C173.1 D5.1(C) R138.1
NetC199_2: C199.2 D5.2(A) IC3.3(~{MR}) R139.1
NetC202_2: C202.2 C203.2 IC31.80(AVCC1) L14.2
NetD20_1: D20.1 J3.13 R145.1
NetD20_2: D20.2 J3.14 R146.1
NetIC31_21: IC31.21(PJ.0/TDO/TB0OUTH/SMCLK/SRSCG1/C6) R141.2
NetIC31_22: IC31.22(PJ.1/TDI/TCLK/MCLK/SRSCG0/C7) R142.2
NetIC31_23: IC31.23(PJ.2/TMS/ACLK/SROSCOFF/C8) R143.2
NetIC31_24: IC31.24(PJ.3/TCK/SRCPUOFF/C9) R144.2
NetIC31_37: IC31.37(TEST/SBWTCK) R136.2

Not connected (* = marked no-connect by the designer): IC3 4(CT); IC31 74(PJ.6/HFXIN) 75(PJ.7/HFXOUT) 77(PJ.4/LFXIN) 78(PJ.5/LFXOUT); J3 6* 10* 12*

### Notes on the sheet
- AC coupled reset. Compliant with 10ms low pulse, defined in SVPX.
- (near J3) Verify JTAG connection. Documentation connects 1 pin of the connector to "TDI/TDO" pin uC.
  IO description does not contain a pin described as "TDI/TDO".
- (near IC23) Probably will use internal RC OSC
- Project/Equipment
- Document
- Designer
- Drawn by
- Check.by
- Copyright WUT ISE 2019
  This documentation describes Open Hardware and is licensed under the CERN OHL v.1.1. You may redistribute and modify this documentation under the terms of the CERN OHL v1.1.
  (http://ohwr.org/CERNOHL). This documentation is dristributed WITHOUT ANY EXPRESS OR IMPLIED WARRANTY, INCLUDING OF MERCHANTABILITY, SATISFACTORY QUALITY AND FITNESS FOR A PARTICULAR PURPOSE. Please see the CERN OHL v.1.1 for applicable conditions
- File
- Last Mod.
- Print Date
- Sheet
- Size
- A4
- of
- Rev
- (in symbol R0402_1K_1%_0.0625W_100PPM) 1%
- (in symbol R0402_47K_1%_0.0625W_100PPM) 1%
- (in symbol R0402_100K_1%_0.0625W_100PPM) 1%
- (in symbol R0402_100R_1%_0.0625W_100PPM) 1%

### Library data of the parts
C41#2 C201 C203 = CC0402_100NF_25V_10%_X7R_YUDEN_TMK105B7104KVHF: as C161-C163 on sheet Decoupling_caps; Part Number: CC0402_100NF_25V_10%_X7R_YUDEN_TMK105B7104KVHF; Component Kind: Standard; Component Type: Standard; Pin Count: 2; Value: 100nF; Status: Not Recommended; Manufacturer Part Number: TMK105B7104KVHF; Case: 0402; Mounted: Yes; Socket: No; SMD: Yes; Sense: No; HelpURL: \\cern.ch\dfs\Applications\Altium\Datasheets\CC0402_TAIYO-YUDEN_TMK105B7104KVHF.pdf; Author: CERN DEM JLC; CreateDate: 10.05.2017; LatestRevisionDate: 10.05.2017; ComponentHeight: 0.55mm
C172 = CC0402_1NF_50V_10%_X7R: Non-polarised capacitor; Part Description: SMD Multilayer Chip Ceramic Capacitor; Manufacturer: GENERIC; Manufacturer1 Part Number: 223858715623; Voltage: 50V; TC: X7R; Tolerance: ±10%; Part Number: CC0402_1NF_50V_10%_X7R; Component Kind: Standard; Component Type: Standard; Pin Count: 2; Value: 1nF; Status: Not Recommended; Manufacturer Part Number: CC0402_1NF_50V_10%_X7R; Case: 0402; Mounted: Yes; Socket: No; SMD: Yes; Sense: No; Manufacturer1 Example: PHYCOMP; Manufacturer1 ComponentHeight: 0.55mm; HelpURL: \\cern.ch\dfs\Applications\Altium\Datasheets\CC0402_X7R_PHYCOMP.pdf; Author: CERN DEM JLC; CreateDate: 03.12.2007; LatestRevisionDate: 03.12.2007
C173 C202 = CC0603_10UF_16V_20%_X5R: Non-polarised capacitor; Part Description: SMD Multilayer Chip Ceramic Capacitor; Manufacturer: GENERIC; Manufacturer1 Part Number: GRM188R61C106MA73D; Voltage: 16V; TC: X5R; Tolerance: ±20%; Part Number: CC0603_10UF_16V_20%_X5R; Component Kind: Standard; Component Type: Standard; Pin Count: 2; Value: 10uF; Status: None; Manufacturer Part Number: CC0603_10UF_16V_20%_X5R; Case: 0603; Mounted: Yes; Socket: No; SMD: Yes; Sense: No; Manufacturer1 Example: MURATA; Manufacturer1 ComponentHeight: 0.8mm; HelpURL: \\cern.ch\dfs\Applications\Altium\Datasheets\CC0603_X5R_MURATA_GRM.pdf; Author: CERN DEM MR; CreateDate: 2016-03-02; LatestRevisionDate: 2016-03-02
C199 = CC0402_10NF_50V_10%_X7R: Non-polarised capacitor; Part Description: SMD Multilayer Chip Ceramic Capacitor; Manufacturer: GENERIC; Manufacturer1 Part Number: GRM155R71H103KA88D; Voltage: 50V; TC: X7R; Tolerance: ±10%; Part Number: CC0402_10NF_50V_10%_X7R; Component Kind: Standard; Component Type: Standard; Pin Count: 2; Value: 10nF; Status: None; Manufacturer Part Number: CC0402_10NF_50V_10%_X7R; Case: 0402; Mounted: Yes; Socket: No; SMD: Yes; Sense: No; Manufacturer1 Example: MURATA; Manufacturer1 ComponentHeight: 0.55mm; HelpURL: \\cern.ch\dfs\Applications\Altium\Datasheets\CC0402_X7R_MURATA_GRM.pdf; Author: CERN DEM MR; CreateDate: 08.01.2016; LatestRevisionDate: 08.01.2016
D5 = BAT165: Schottky Diode; Part Description: Medium Power AF Schottky Diode; Manufacturer: INFINEON; Voltage: 40V; Power: 750mA; PressFit: No; Bonding: No; Part Number: BAT165; Component Kind: Standard; Component Type: Standard; Device: BAT165; PackageDescription: Small Outline Diode (SOD-323), 1.70mm W X 1.25mm L X 1.10mm H body,  IPC Medium Density; Manufacturer Part Number: BAT165; Pin Count: 2; Case: SOD323; Mounted: Yes; Socket: No; SMD: Yes; Sense: No; ComponentHeight: 1.1mm; HelpURL: \\cern.ch\dfs\Applications\Altium\Datasheets\BAT165.pdf; Author: CERN DEM JLC; CreateDate: 12.11.2014; LatestRevisionDate: 12.11.2014
D12 D14 D15 D20 = ESD7C3.3DT5G: as D19 on sheet SLT3-PAY-1Q2T_P1; Case: SOT-723; Component Kind: Standard; Component Type: Standard; CreateDate: 2018-06-18; Device: TVS diode; HelpURL: https://www.onsemi.com/pub/Collateral/ESD7C3.3D-D.PDF; LatestRevisionDate: 2018-06-18; Manufacturer Part Number: ESD7C3.3DT5G; Mounted: Yes; PackageDescription: SOT-723; Part Description: TVS diode; Part Number: ESD7C3.3DT5G; Pin Count: 3; Sense: No; SMD: Yes; Socket: No
IC3 = TPS3808G33DBVT: Low Quiescent Current, Programmable-Delay Supervisory Circuit; Part Description: 3.3V, Low Quiescent Current, Programmable-Delay Supervisory Circuit; Manufacturer: TEXAS INSTRUMENTS; PressFit: No; Bonding: No; Part Number: TPS3808G33DBVT; Component Kind: Standard; Component Type: Standard; Device: TPS3808G33DBVT; PackageDescription: SOT23, 6-Leads, Body 1.6x3.0mm, Pitch 0.95mm, IPC Medium Density; Manufacturer Part Number: TPS3808G33DBVT; Pin Count: 6; Case: SOT23-6; Mounted: Yes; Socket: No; SMD: Yes; Sense: No; ComponentHeight: 1.45mm; Author: CERN DEM JLC; HelpURL: \\cern.ch\dfs\Applications\Altium\Datasheets\TPS3808G33DBVT.pdf; CreateDate: 05.11.2013; LatestRevisionDate: 05.11.2013
IC23 = DSC1001DL5-012.0000: MEMS Oscillator 12MHz; Manufacturer: Micrel; Bonding: No; PressFit: No; Case: *; Component Kind: Standard; Component Type: Standard; ComponentHeigth: *; CreateDate: 2018-05-21; Device: DSC1001DL5-012.0000; Footprint: MICREL SMD Oscillator, QFN, 4 pins, 2.5mm x 2.0mm; HelpURL: *; LatestRevisionDate: 2018-05-21; Manufacturer Part Number: DSC1001DL5-012.0000; Mounted: Yes; PackageDescription: MICREL SMD Oscillator, QFN, 4 pins, 2.5mm x 2.0mm; Part Description: MEMS Oscillator 12MHz; Part Number: DSC1001DL5-012.0000; Pin Count: 4; Sense: No; SMD: Yes; Socket: No; Value: *
IC31 = MSP430FR5994IPN: as IC31 on sheet Management; Case: LQFP80; Component Kind: Standard; Component Type: Standard; CreateDate: 2018-01-01; Device: MSP430FR5994IPN; Footprint: LQFP80; HelpURL: *; LatestRevisionDate: 2018-01-01; Manufacturer Part Number: MSP430FR5994IPN; Mounted: Yes; PackageDescription: LQFP80; Part Number: MSP430FR5994IPN; Pin Count: 80; Sense: No; SMD: Yes; Socket: No; Value: *
J3 = SHF-107-01-L-D-SM: Header, 14 contacts, Pitch 1,27mm, Double Row, SMD; Manufacturer: Samtec; Part Description: Horizontal header, 14 contacts, Pitch 2.54mm, Double Row, SMD; Bonding: No; ComponentHeigth: 6.1mm; PressFit: No; Case: SHF-107-01-L-D-SM; Component Kind: Standard; Component Type: Standard; CreateDate: 2018-12-07; Device: SHF-107-01-L-D-SM; Footprint: SHF-107-01-L-D-SM; HelpURL: http://suddendocs.samtec.com/prints/shf-1xx-01-x-d-xx-xx-footprint.pdf; LatestRevisionDate: 2018-12-07; Manufacturer Part Number: SHF-107-01-L-D-SM; Mounted: Yes; Part Number: SHF-107-01-L-D-SM; Pin Count: 14; Sense: No; SMD: No; Socket: No; Value: *
L14 = IND0603_MURATA_BLM18HE102SN1: Inductor; Part Description: SMD EMIFIL Suppression Chip Ferrite Bead; Manufacturer: MURATA; Power: 600mA; Resistance: 0.35R; Tolerance: ±25%; Part Number: IND0603_MURATA_BLM18HE102SN1; Component Kind: Standard; Component Type: Standard; Pin Count: 2; Value: 1000R@100MHz; Status: None; Manufacturer Part Number: BLM18HE102SN1; Case: 0603; Mounted: Yes; Socket: No; SMD: Yes; Sense: No; ComponentHeight: 0.95mm; HelpURL: \\cern.ch\dfs\Applications\Altium\Datasheets\IND0603_MURATA_BLM18H.pdf; Author: CERN DEM JLC; CreateDate: 09/12/2013; LatestRevisionDate: 09/12/2013
R136 R141-R144 = R0402_100R_1%_0.0625W_100PPM: Resistor - 1%; Part Description: General Purpose Thick Film Chip Resistor; Manufacturer: GENERIC; Manufacturer1 Part Number: 232270671001L; TC: ±100ppm/°C; PressFit: No; Part Number: R0402_100R_1%_0.0625W_100PPM; Component Kind: Standard; Component Type: Standard; Pin Count: 2; Value: 100; Status: Not Recommended; Power: 0.0625W; Tolerance: ±1%; Manufacturer Part Number: R0402_100R_1%_0.0625W_100PPM; Case: 0402; Mounted: Yes; Sense: No; Socket: No; SMD: Yes; Manufacturer1 Example: YAGEO PHYCOMP; Manufacturer1 ComponentHeight: 0.4mm; HelpURL: \\cern.ch\dfs\Applications\Altium\Datasheets\R0402_Phycomp_RC0402.pdf; Author: CERN DEM JLC; CreateDate: 03.12.2007; LatestRevisionDate: 17.10.2012
R137 = R0402_1K_1%_0.0625W_100PPM: as R197 on sheet Management; Part Number: R0402_1K_1%_0.0625W_100PPM; Component Kind: Standard; Component Type: Standard; Pin Count: 2; Value: 1k; Status: Not Recommended; Power: 0.0625W; Tolerance: ±1%; Manufacturer Part Number: R0402_1K_1%_0.0625W_100PPM; Case: 0402; Mounted: Yes; Sense: No; Socket: No; SMD: Yes; Manufacturer1 Example: YAGEO PHYCOMP; Manufacturer1 ComponentHeight: 0.4mm; HelpURL: \\cern.ch\dfs\Applications\Altium\Datasheets\R0402_Phycomp_RC0402.pdf; Author: CERN DEM JLC; CreateDate: 03.12.2007; LatestRevisionDate: 17.10.2012
R138 = R0402_100K_1%_0.0625W_100PPM: as R160 on sheet Management; Part Number: R0402_100K_1%_0.0625W_100PPM; Component Kind: Standard; Component Type: Standard; Pin Count: 2; Value: 100k; Status: Not Recommended; Power: 0.0625W; Tolerance: ±1%; Manufacturer Part Number: R0402_100K_1%_0.0625W_100PPM; Case: 0402; Mounted: Yes; Sense: No; Socket: No; SMD: Yes; Manufacturer1 Example: YAGEO PHYCOMP; Manufacturer1 ComponentHeight: 0.4mm; HelpURL: \\cern.ch\dfs\Applications\Altium\Datasheets\R0402_Phycomp_RC0402.pdf; Author: CERN DEM JLC; CreateDate: 03.12.2007; LatestRevisionDate: 17.10.2012
R139 = R0402_47K_1%_0.0625W_100PPM: as R130-R135 on sheet Management; Part Number: R0402_47K_1%_0.0625W_100PPM; Component Kind: Standard; Component Type: Standard; Pin Count: 2; Value: 47k; Status: Not Recommended; Power: 0.0625W; Tolerance: ±1%; Manufacturer Part Number: R0402_47K_1%_0.0625W_100PPM; Case: 0402; Mounted: Yes; Sense: No; Socket: No; SMD: Yes; Manufacturer1 Example: YAGEO PHYCOMP; Manufacturer1 ComponentHeight: 0.4mm; HelpURL: \\cern.ch\dfs\Applications\Altium\Datasheets\R0402_Phycomp_RC0402.pdf; Author: CERN DEM JLC; CreateDate: 03.12.2007; LatestRevisionDate: 17.10.2012
R140 R145 R146 = R0603_0R_JUMPER: Resistor; Part Description: 1A (0.05R Max DC Resistance) Zero Ohm Jumper; Manufacturer: GENERIC; Manufacturer1 Part Number: NRC06Z0; PressFit: No; Part Number: R0603_0R_JUMPER; Component Kind: Standard; Component Type: Standard; Pin Count: 2; Value: 0; Status: Preferred; Manufacturer Part Number: R0603_0R_JUMPER; Case: 0603; Mounted: Yes; Sense: No; Socket: No; SMD: Yes; Manufacturer1 Example: NIC COMPONENT; Manufacturer1 ComponentHeight: 0.55mm; HelpURL: \\cern.ch\dfs\Applications\Altium\Datasheets\R0603_NIC_NRC.pdf; Author: CERN DEM JLC; CreateDate: 03.12.2007; LatestRevisionDate: 13.03.2008

## Sheet WR_OSC.SchDoc: SVPXFMC Carrier 3U
size A4; CheckedBy: \; Author: T.Przywozki; CompanyName: ISE; DrawnBy: T.Przywozki; Organization: WUT ISE; Address1: Warsaw University of Technology; Address2: Nowowiejska 15/19 00-665 Warsaw; Revision: 1.0.; SheetNumber: 15; SheetTotal: 20; Project: SVPXFMC Carrier 3U; ModifiedBy: -; CheckedDate: -; Title2: WR Oscillators; DivGrp: ISE; Designer: T.Przywozki
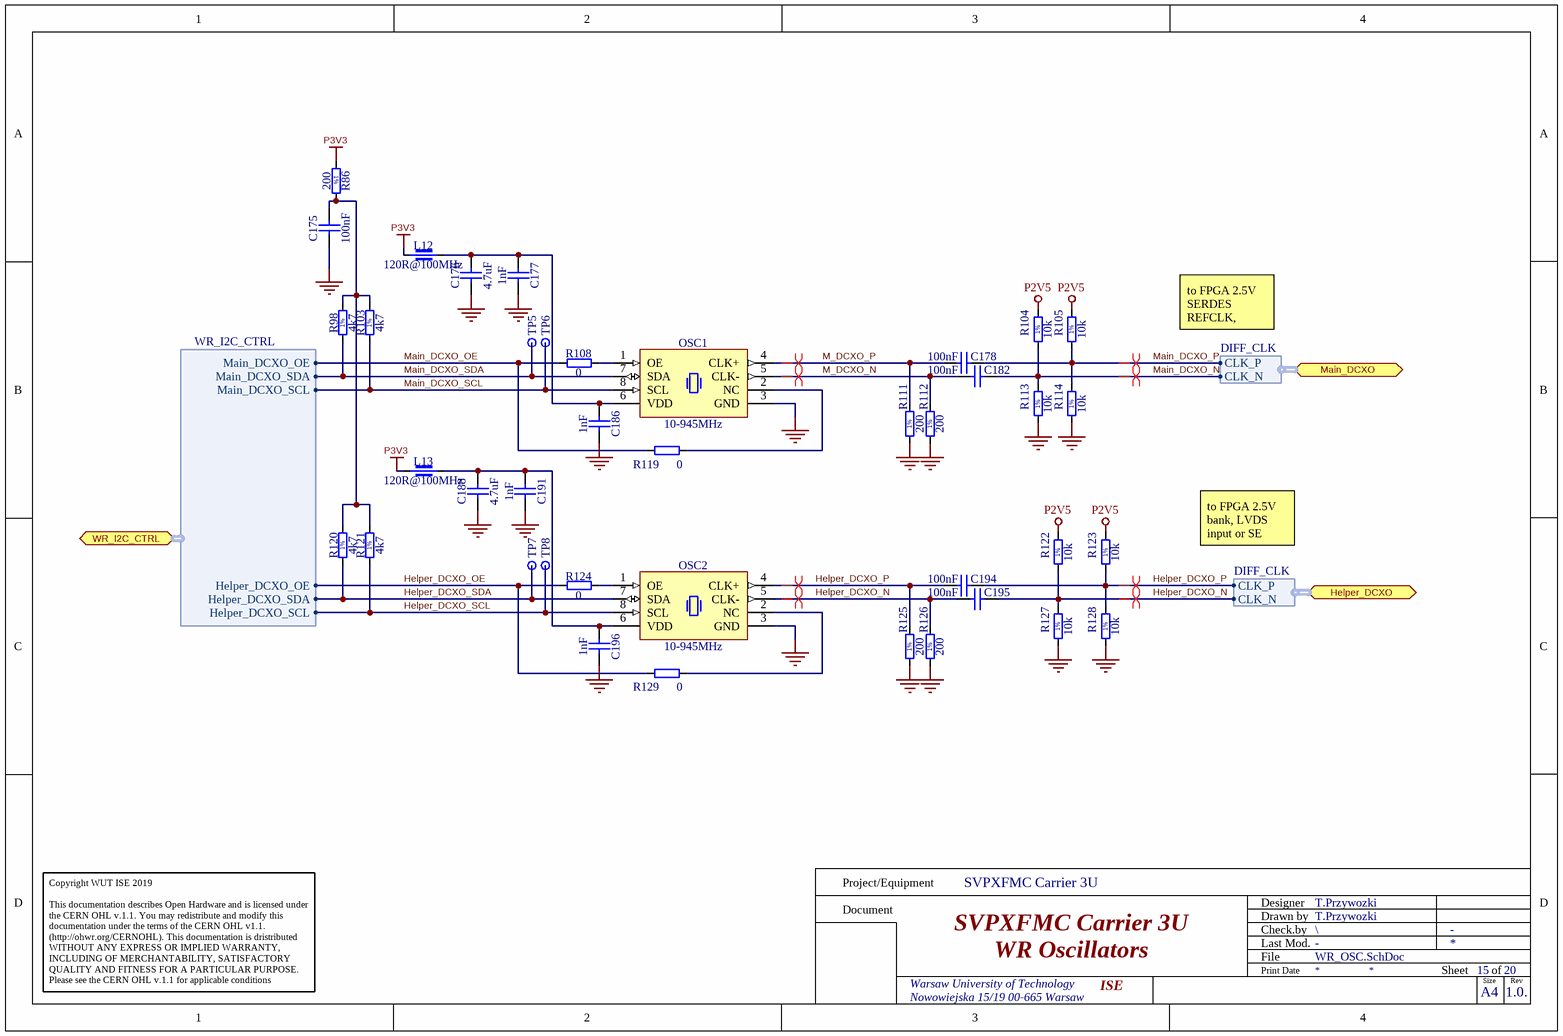
[diagram p18: WR_OSC.SchDoc]

### Parts
C175  100nF  [CAPC0603X33N]
C176  4.7uF  [CAPC1608X90N]
C177  1nF  [CAPC0603X33N]
C178  100nF  [CAPC1005X55N]
C182  100nF  [CAPC1005X55N]
C186  1nF  [CAPC0603X33N]
C188  4.7uF  [CAPC1608X90N]
C191  1nF  [CAPC0603X33N]
C194  100nF  [CAPC1005X55N]
C195  100nF  [CAPC1005X55N]
C196  1nF  [CAPC0603X33N]
L12  120R@100MHz  [INDC1608X95N]
L13  120R@100MHz  [INDC1608X95N]
OSC1  10-945MHz  [OSC_SILICON-LAB_SI570]
OSC2  10-945MHz  [OSC_SILICON-LAB_SI570]
R86  200  [RESC1005X40N]
R98  4k7  [RESC1005X40N]
R103  4k7  [RESC1005X40N]
R104  10k  [RESC1005X40N]
R105  10k  [RESC1005X40N]
R108  0  [RESC1005X40N]
R111  200  [RESC1005X40N]
R112  200  [RESC1005X40N]
R113  10k  [RESC1005X40N]
R114  10k  [RESC1005X40N]
R119  0  [RESC1005X40N]
R120  4k7  [RESC1005X40N]
R121  4k7  [RESC1005X40N]
R122  10k  [RESC1005X40N]
R123  10k  [RESC1005X40N]
R124  0  [RESC1005X40N]
R125  200  [RESC1005X40N]
R126  200  [RESC1005X40N]
R127  10k  [RESC1005X40N]
R128  10k  [RESC1005X40N]
R129  0  [RESC1005X40N]
TP5  Test Point  [TPS127]  (value not drawn)
TP6  Test Point  [TPS127]  (value not drawn)
TP7  Test Point  [TPS127]  (value not drawn)
TP8  Test Point  [TPS127]  (value not drawn)

### Ports
Helper_DCXO (bidir, harness DIFF_CLK), Main_DCXO (bidir, harness DIFF_CLK), WR_I2C_CTRL (bidir, harness WR_I2C_CTRL)

### Harnesses
WR_I2C_CTRL: Main_DCXO_OE, Main_DCXO_SDA, Main_DCXO_SCL, Helper_DCXO_OE, Helper_DCXO_SDA, Helper_DCXO_SCL
DIFF_CLK: CLK_N, CLK_P

### Nets
GND: C175.1 C176.1 C177.1 C186.1 C188.1 C191.1 C196.1 OSC1.3(GND) OSC2.3(GND) R111.1 R112.1 R113.1 R114.1 R125.1 R126.1 R127.1 R128.1
P2V5: R104.2 R105.2 R122.2 R123.2
P3V3: L12.1 L13.1 R86.1
Helper_DCXO_N: C195.1 C195.2 OSC2.5(CLK-) R122.1 R126.2 R127.2 ; port Helper_DCXO.CLK_N
Helper_DCXO_OE: R124.1 R129.1 ; port WR_I2C_CTRL.Helper_DCXO_OE
Helper_DCXO_P: C194.1 C194.2 OSC2.4(CLK+) R123.1 R125.2 R128.2 ; port Helper_DCXO.CLK_P
Helper_DCXO_SCL: OSC2.8(SCL) R121.1 TP8.1 ; port WR_I2C_CTRL.Helper_DCXO_SCL
Helper_DCXO_SDA: OSC2.7(SDA) R120.1 TP7.1 ; port WR_I2C_CTRL.Helper_DCXO_SDA
M_DCXO_N: C182.1 OSC1.5(CLK-) R112.2  [project net M_DCXO_N_15]
M_DCXO_P: C178.1 OSC1.4(CLK+) R111.2  [project net M_DCXO_P_15]
Main_DCXO_N: C182.2 R104.1 R113.2 ; port Main_DCXO.CLK_N
Main_DCXO_OE: R108.1 R119.1 ; port WR_I2C_CTRL.Main_DCXO_OE
Main_DCXO_P: C178.2 R105.1 R114.2 ; port Main_DCXO.CLK_P
Main_DCXO_SCL: OSC1.8(SCL) R103.1 TP6.1 ; port WR_I2C_CTRL.Main_DCXO_SCL
Main_DCXO_SDA: OSC1.7(SDA) R98.1 TP5.1 ; port WR_I2C_CTRL.Main_DCXO_SDA
NetC175_2: C175.2 R86.2 R98.2 R103.2 R120.2 R121.2
NetC176_2: C176.2 C177.2 C186.2 L12.2 OSC1.6(VDD)
NetC188_2: C188.2 C191.2 C196.2 L13.2 OSC2.6(VDD)
NetOSC1_1: OSC1.1(OE) R108.2
NetOSC1_2: OSC1.2(NC) R119.2
NetOSC2_1: OSC2.1(OE) R124.2
NetOSC2_2: OSC2.2(NC) R129.2

### Layout directives
differential pair: Helper_DCXO_N, Helper_DCXO_P, M_DCXO_N_15, M_DCXO_P_15, Main_DCXO_N, Main_DCXO_P

### Notes on the sheet
- to FPGA 2.5V SERDES REFCLK, LVDS input
- to FPGA 2.5V bank, LVDS input or SE mode
- Project/Equipment
- Document
- Designer
- Drawn by
- Check.by
- Copyright WUT ISE 2019
  This documentation describes Open Hardware and is licensed under the CERN OHL v.1.1. You may redistribute and modify this documentation under the terms of the CERN OHL v1.1.
  (http://ohwr.org/CERNOHL). This documentation is dristributed WITHOUT ANY EXPRESS OR IMPLIED WARRANTY, INCLUDING OF MERCHANTABILITY, SATISFACTORY QUALITY AND FITNESS FOR A PARTICULAR PURPOSE. Please see the CERN OHL v.1.1 for applicable conditions
- File
- Last Mod.
- Print Date
- Sheet
- Size
- A4
- of
- Rev
- (in symbol R0402_4K7_1%_0.0625W_100PPM) 1%
- (in symbol R0402_10K_1%_0.0625W_100PPM) 1%
- (in symbol R0402_200R_1%_0.0625W_100PPM) 1%

### Library data of the parts
C175 = CC0201_100NF_6.3V_10%_X5R: Non-polarised capacitor; Manufacturer: GENERIC; Part Description: SMD Multilayer Chip Ceramic Capacitor; Manufacturer1 Part Number: 02016D104KAT2A; Tolerance: ±10%; Voltage: 6.3V; TC: X5R; Manufacturer Part Number: CC0201_100NF_6.3V_10%_X5R; Part Number: CC0201_100NF_6.3V_10%_X5R; Value: 100nF; Component Kind: Standard; Component Type: Standard; Pin Count: 2; Status: Not Recommended; Case: 0201; Mounted: Yes; Socket: No; SMD: Yes; Sense: No; Manufacturer1 Example: AVX; Manufacturer1 ComponentHeight: 0.33mm; HelpURL: \\cern.ch\dfs\Applications\Altium\Datasheets\CC0201_X5R_AVX.pdf; Author: CERN DEM JLC; CreateDate: 03.12.2007; LatestRevisionDate: 03.12.2007
C176 C188 = CC0603_4.7UF_25V_10%_X5R: Non-polarised capacitor; Manufacturer: GENERIC; Part Description: SMD Multilayer Chip Ceramic Capacitor; Manufacturer1 Part Number: GRM188R61E475KE11D; Tolerance: ±10%; Voltage: 25V; TC: X5R; Manufacturer Part Number: CC0603_4.7UF_25V_10%_X5R; Part Number: CC0603_4.7UF_25V_10%_X5R; Value: 4.7uF; Component Kind: Standard; Component Type: Standard; Pin Count: 2; Status: None; Case: 0603; Mounted: Yes; Socket: No; SMD: Yes; Sense: No; Manufacturer1 Example: MURATA; Manufacturer1 ComponentHeight: 0.95mm; HelpURL: \\cern.ch\dfs\Applications\Altium\Datasheets\CC0603_MURATA_GRM188R61E475KE11D.pdf; Author: CERN DEM JLC; CreateDate: 10.11.2014; LatestRevisionDate: 10.11.2014
C177 C186 C191 C196 = CC0201_1NF_16V_10%_X5R: Non-polarised capacitor; Manufacturer: GENERIC; Part Description: SMD Multilayer Chip Ceramic Capacitor; Manufacturer1 Part Number: 0201YD102KAT2A; Tolerance: ±10%; Voltage: 16V; TC: X5R; Manufacturer Part Number: CC0201_1NF_16V_10%_X5R; Part Number: CC0201_1NF_16V_10%_X5R; Value: 1nF; Component Kind: Standard; Component Type: Standard; Pin Count: 2; Status: Not Recommended; Case: 0201; Mounted: Yes; Socket: No; SMD: Yes; Sense: No; Manufacturer1 Example: AVX; Manufacturer1 ComponentHeight: 0.33mm; HelpURL: \\cern.ch\dfs\Applications\Altium\Datasheets\CC0201_X5R_AVX.pdf; Author: CERN DEM JLC; CreateDate: 03.12.2007; LatestRevisionDate: 03.12.2007
C178 C182 C194 C195 = CC0402_100NF_16V_10%_X5R: Non-polarised capacitor; Manufacturer: GENERIC; Manufacturer1 Part Number: GRM155R61C104KA88D; Part Description: SMD Multilayer Chip Ceramic Capacitor; TC: X5R; Tolerance: ±10%; Voltage: 16V; Case: 0402; Manufacturer Part Number: CC0402_100NF_16V_10%_X5R; Manufacturer1 Example: MURATA; Part Number: CC0402_100NF_16V_10%_X5R; Pin Count: 2; SMD: Yes; Status: None; Value: 100nF; Component Kind: Standard; Component Type: Standard; Mounted: Yes; Socket: No; Sense: No; Manufacturer1 ComponentHeight: 0.55mm; HelpURL: \\cern.ch\dfs\Applications\Altium\Datasheets\CC0402_X5R_MURATA_GRM.pdf; Author: CERN DEM JLC; CreateDate: 10.12.2013; LatestRevisionDate: 10.12.2013
L12 L13 = IND0603_MURATA_BLM18PG121SN1D: Manufacturer: MURATA; Part Description: SMD EMIFIL Chip Ferrite Bead; Power: 2A; Resistance: 0.05R; Manufacturer Part Number: BLM18PG121SN1D; Part Number: IND0603_MURATA_BLM18PG121SN1D; Value: 120R@100MHz; Component Kind: Standard; Component Type: Standard; Pin Count: 2; Status: None; Case: 0603; Mounted: Yes; Socket: No; SMD: Yes; Sense: No; ComponentHeight: 0.95mm; HelpURL: \\cern.ch\dfs\Applications\Altium\Datasheets\IND0603_MURATA_BLM18P.pdf; Author: CERN DEM BC; CreateDate: 27.07.2015; LatestRevisionDate: 25.10.2018
OSC1 OSC2 = 570ACA001527DGR: Ultra Low Jitter I2C Programmable XO (95 fs), 0.2 to 250MHz; Manufacturer: Silabs; Part Description: 10 MHZ TO 945 MHZ I2C PROGRAMMABLE XO/VCXO; Part Name: OSC_10-945MHZ_SILICON-LAB_Si570ACA001527DGR; Part Number: OSC_10_945M_SILICON-LAB_570ACA001527DGR; Tolerance: 20ppm; Voltage: 3V3; Case: OSC_SILICON-LAB_SI570; Cell Name: OSC_SILICON-LAB_SI570; Device: 570ACA001527DGR; Manufacturer Part Number: 570ACA001527DGR; Value: 10-945MHz
R86 R111 R112 R125 R126 = R0402_200R_1%_0.0625W_100PPM: Resistor - 1%; Manufacturer: GENERIC; Part Description: General Purpose Thick Film Chip Resistor; Manufacturer1 Part Number: 232270672001L; TC: ±100ppm/°C; PressFit: No; Manufacturer Part Number: R0402_200R_1%_0.0625W_100PPM; Part Number: R0402_200R_1%_0.0625W_100PPM; Tolerance: ±1%; Value: 200; Component Kind: Standard; Component Type: Standard; Pin Count: 2; Status: Not Recommended; Power: 0.0625W; Case: 0402; Mounted: Yes; Sense: No; Socket: No; SMD: Yes; Manufacturer1 Example: YAGEO PHYCOMP; Manufacturer1 ComponentHeight: 0.4mm; HelpURL: \\cern.ch\dfs\Applications\Altium\Datasheets\R0402_Phycomp_RC0402.pdf; Author: CERN DEM JLC; CreateDate: 03.12.2007; LatestRevisionDate: 17.10.2012
R98 R103 R120 R121 = R0402_4K7_1%_0.0625W_100PPM: Resistor - 1%; Manufacturer: GENERIC; Part Description: General Purpose Thick Film Chip Resistor; Manufacturer1 Part Number: 232270674702L; TC: ±100ppm/°C; PressFit: No; Manufacturer Part Number: R0402_4K7_1%_0.0625W_100PPM; Part Number: R0402_4K7_1%_0.0625W_100PPM; Tolerance: ±1%; Value: 4k7; Component Kind: Standard; Component Type: Standard; Pin Count: 2; Status: Not Recommended; Power: 0.0625W; Case: 0402; Mounted: Yes; Sense: No; Socket: No; SMD: Yes; Manufacturer1 Example: YAGEO PHYCOMP; Manufacturer1 ComponentHeight: 0.4mm; HelpURL: \\cern.ch\dfs\Applications\Altium\Datasheets\R0402_Phycomp_RC0402.pdf; Author: CERN DEM JLC; CreateDate: 03.12.2007; LatestRevisionDate: 17.10.2012
R104 R105 R113 R114 R122 R123 R127 R128 = R0402_10K_1%_0.0625W_100PPM: Resistor - 1%; Manufacturer: GENERIC; Part Description: General Purpose Thick Film Chip Resistor; Manufacturer1 Part Number: 232270671003L; TC: ±100ppm/°C; PressFit: No; Manufacturer Part Number: R0402_10K_1%_0.0625W_100PPM; Part Number: R0402_10K_1%_0.0625W_100PPM; Tolerance: ±1%; Value: 10k; Component Kind: Standard; Component Type: Standard; Pin Count: 2; Status: Not Recommended; Power: 0.0625W; Case: 0402; Mounted: Yes; Sense: No; Socket: No; SMD: Yes; Manufacturer1 Example: YAGEO PHYCOMP; Manufacturer1 ComponentHeight: 0.4mm; HelpURL: \\cern.ch\dfs\Applications\Altium\Datasheets\R0402_Phycomp_RC0402.pdf; Author: CERN DEM JLC; CreateDate: 03/12/2007; LatestRevisionDate: 17/10/2012
R108 R119 R124 R129 = R0402_0R_JUMPER: Resistor; Manufacturer: GENERIC; Part Description: 1A (0.05R Max DC Resistance) Zero Ohm Jumper; Manufacturer1 Part Number: 232270591001L; PressFit: No; Manufacturer Part Number: R0402_0R_JUMPER; Part Number: R0402_0R_JUMPER; Value: 0; Component Kind: Standard; Component Type: Standard; Pin Count: 2; Status: Not Recommended; Case: 0402; Mounted: Yes; Sense: No; Socket: No; SMD: Yes; Manufacturer1 Example: YAGEO PHYCOMP; Manufacturer1 ComponentHeight: 0.4mm; HelpURL: \\cern.ch\dfs\Applications\Altium\Datasheets\R0402_Phycomp_RC0402.pdf; Author: CERN DEM JLC; CreateDate: 03.12.2007; LatestRevisionDate: 17.10.2012
TP5-TP8 = SMD_PAD_1.27X1.27MM: Part Description: 1.27mm x 1.27mm PCB Copper Area (SMD Test Point); Mounted: No; Part Number: SMD_PAD_1.27X1.27MM; Component Kind: Standard (No BOM); Component Type: Standard (No BOM); Pin Count: 1; Family: Test Point; Socket: No; SMD: Yes; Sense: No; Status: None; ComponentHeight: 0mm; HelpURL: Undefined; Author: CERN DEM JLC; CreateDate: 12.01.2008; LatestRevisionDate: 12.01.2008; PackageDescription: 1.27mm x 1.27mm PCB Copper Area (SMD Test Point)